# Altium schematic sheet 1010829PA_HVFlyback_GD_Testboard_GDSupply.SchDoc: Flyback
size A4; CompanyName: drivetek ag; DrawnBy: LME; Address1: industriestrasse 37; Address2: 2555 brügg; Address3: Switzerland; SheetNumber: 2; SheetTotal: 2
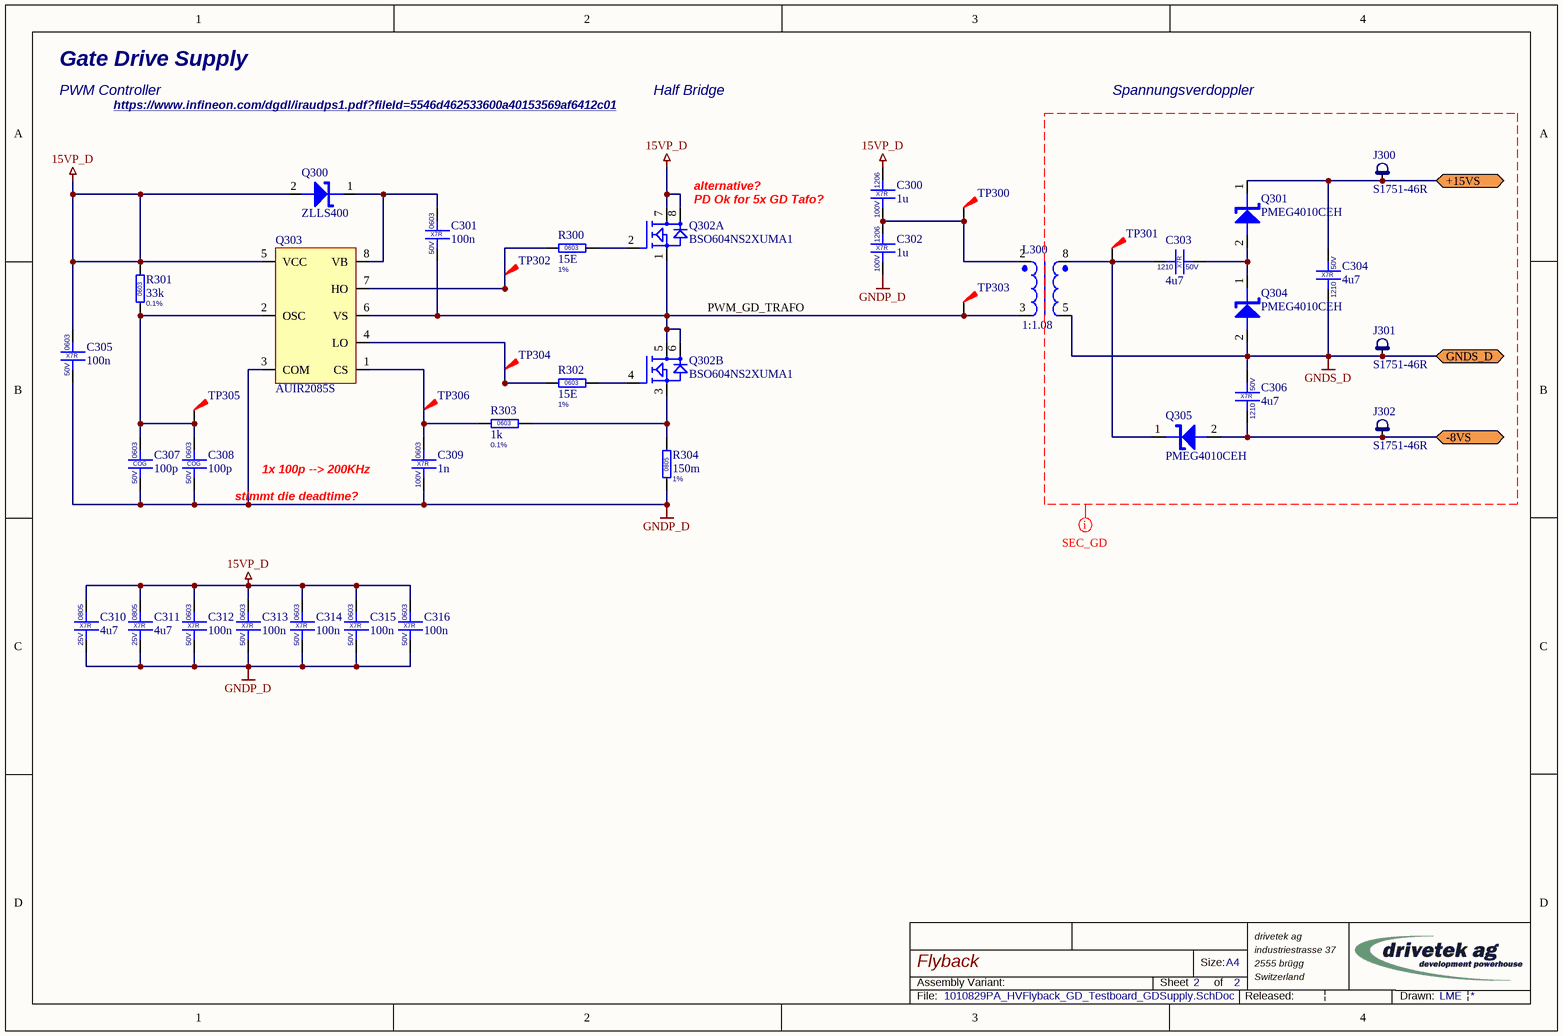
[diagram p0: 1010829PA_HVFlyback_GD_Testboard_GDSupply.SchDoc]

## Parts
C300  1u  CaseName: 1206  Type3: X7R  Voltage: 100V  [02_1206_DRK_3-4x1-8x1-8]
C301  100n  CaseName: 0603  Type3: X7R  Voltage: 50V  [02_0603_DRK_1-7x1-0x0-9]
C302  1u  CaseName: 1206  Type3: X7R  Voltage: 100V  [02_1206_DRK_3-4x1-8x1-8]
C303  4u7  CaseName: 1210  Type3: X7R  Voltage: 50V  [02_1210_DRK_3-2x2-6x2-7]
C304  4u7  CaseName: 1210  Type3: X7R  Voltage: 50V  [02_1210_DRK_3-2x2-6x2-7]
C305  100n  CaseName: 0603  Type3: X7R  Voltage: 50V  [02_0603_DRK_1-7x1-0x0-9]
C306  4u7  CaseName: 1210  Type3: X7R  Voltage: 50V  [02_1210_DRK_3-2x2-6x2-7]
C307  100p  CaseName: 0603  Type3: COG  Voltage: 50V  [02_0603_DRK_1-7x1-0x0-9]
C308  100p  CaseName: 0603  Type3: COG  Voltage: 50V  [02_0603_DRK_1-7x1-0x0-9]
C309  1n  CaseName: 0603  Type3: X7R  Voltage: 100V  [02_0603_DRK_1-7x1-0x0-9]
C310  4u7  CaseName: 0805  Type3: X7R  Voltage: 25V  [02_0805_DRK_2-2x1-5x1-3]
C311  4u7  CaseName: 0805  Type3: X7R  Voltage: 25V  [02_0805_DRK_2-2x1-5x1-3]
C312  100n  CaseName: 0603  Type3: X7R  Voltage: 50V  [02_0603_DRK_1-7x1-0x0-9]
C313  100n  CaseName: 0603  Type3: X7R  Voltage: 50V  [02_0603_DRK_1-7x1-0x0-9]
C314  100n  CaseName: 0603  Type3: X7R  Voltage: 50V  [02_0603_DRK_1-7x1-0x0-9]
C315  100n  CaseName: 0603  Type3: X7R  Voltage: 50V  [02_0603_DRK_1-7x1-0x0-9]
C316  100n  CaseName: 0603  Type3: X7R  Voltage: 50V  [02_0603_DRK_1-7x1-0x0-9]
J300  S1751-46R  [13_PAD_DRK_HARWIN_S1751-46]
J301  S1751-46R  [13_PAD_DRK_HARWIN_S1751-46]
J302  S1751-46R  [13_PAD_DRK_HARWIN_S1751-46]
L300  1:1.08  [06_TRA_DRK_TDK-B78307A2276A003]
Q300  ZLLS400  [03_SOD323_DRK]
Q301  PMEG4010CEH  [03_SOD123_DRK]
Q302  BSO604NS2XUMA1  [03_SO-8_DRK]  (parts A,B of 2)
Q303  AUIR2085S  [04_SO-8_DRK]
Q304  PMEG4010CEH  [03_SOD123_DRK]
Q305  PMEG4010CEH  [03_SOD123_DRK]
R300  15E  Tolerance: 1%  CaseName: 0603  [01_0603_DRK_1-7x1-0x0-55]
R301  33k  Tolerance: 0.1%  CaseName: 0603  [01_0603_DRK_1-7x1-0x0-55]
R302  15E  Tolerance: 1%  CaseName: 0603  [01_0603_DRK_1-7x1-0x0-55]
R303  1k  Tolerance: 0.1%  CaseName: 0603  [01_0603_DRK_1-7x1-0x0-55]
R304  150m  Tolerance: 1%  CaseName: 0805  [01_0805_DRK_2-2x1-5x0-65]
TP300  TP THT Dia 0.8mm, Hole 0.3mm  [13_TP_0-3_0-8mm]  (value not drawn)  (no BOM)
TP301  TP THT Dia 0.8mm, Hole 0.3mm  [13_TP_0-3_0-8mm]  (value not drawn)  (no BOM)
TP302  TP THT Dia 0.8mm, Hole 0.3mm  [13_TP_0-3_0-8mm]  (value not drawn)  (no BOM)
TP303  TP THT Dia 0.8mm, Hole 0.3mm  [13_TP_0-3_0-8mm]  (value not drawn)  (no BOM)
TP304  TP THT Dia 0.8mm, Hole 0.3mm  [13_TP_0-3_0-8mm]  (value not drawn)  (no BOM)
TP305  TP THT Dia 0.8mm, Hole 0.3mm  [13_TP_0-3_0-8mm]  (value not drawn)  (no BOM)
TP306  TP THT Dia 0.8mm, Hole 0.3mm  [13_TP_0-3_0-8mm]  (value not drawn)  (no BOM)

## Ports
+15VS (bidir), -8VS (bidir), GNDS_D (bidir)

## Nets
15VP_D: C300.1 C305.1 C310.1 C311.1 C312.1 C313.1 C314.1 C315.1 C316.1 Q300.2 Q302.7(D1) Q302.8(D1) Q303.5(VCC) R301.2
GNDP_D: C302.2 C305.2 C307.2 C308.2 C309.2 C310.2 C311.2 C312.2 C313.2 C314.2 C315.2 C316.2 Q303.3(COM) R304.1
GNDS_D: C304.1 C306.2 J301.1 L300.5 Q304.2 ; port GNDS_D
+15VS: C304.2 J300.1 Q301.1 ; port +15VS
-8VS: C306.1 J302.1 Q305.2 ; port -8VS
PWM_GD_TRAFO: C301.2 L300.3 Q302.1(S1) Q302.5(D2) Q302.6(D2) Q303.6(VS) TP303.1
NetC300_2: C300.2 C302.1 L300.2 TP300.1
NetC301_1: C301.1 Q300.1 Q303.8(VB)
NetC303_1: C303.1 L300.8 Q305.1 TP301.1
NetC303_2: C303.2 Q301.2 Q304.1
NetC307_1: C307.1 C308.1 Q303.2(OSC) R301.1 TP305.1
NetC309_1: C309.1 Q303.1(CS) R303.2 TP306.1
NetQ302_2: Q302.2(G1) R300.2
NetQ302_3: Q302.3(S2) R303.1 R304.2
NetQ302_4: Q302.4(G2) R302.2
NetQ303_4: Q303.4(LO) R302.1 TP304.1
NetQ303_7: Q303.7(HO) R300.1 TP302.1

## Layout directives
net class SEC_GD: GNDS_D

## Notes on the sheet
- Gate Drive Supply
- PWM Controller
- https://www.infineon.com/dgdl/iraudps1.pdf?fileId=5546d462533600a40153569af6412c01
- Half Bridge
- Spannungsverdoppler
- (near Q302) PD Ok for 5x GD Tafo?
- (near Q302) alternative?
- (near C308) stimmt die deadtime?
- 1x 100p --> 200KHz
- Assembly Variant:
- Sheet
- Size:
- of
- A4
- File:
- Released:
- |
- Drawn:

## Library data of the parts
C300 C302 = 02-0297: Part Description: Ceramic 1206 1u 100V X7R; Manufacturer 1: TDK; Manufacturer Part Number 1: C3216X7R2A105KT5; LatestRevision Note: Initial; Type1: CAP; Type2: Ceramic; Tolerance: 10; Order Number: 810-C3216X7R2A105KT5; Part Number: 02-0297; Author: CSI; PartValue: 1u; ROHS: True; ComponentLink1Description: Datasheet; ComponentLink1URL: http://www.tdk.com/pdf/general_B11.pdf; LatestRevision Date: 07.05.2013; Distributor: Mouser; Price: 0.2
C301 C305 C312-C316 = 02-0342: Part Description: Ceramic 0603 100nF 50V X7R, AEC-Q200, Fail-Save, Deflecting Crack; Manufacturer 1: Murata; Manufacturer Part Number 1: GCJ188R71H104KA12D; LatestRevision Note: Initial; Type1: CAP; Type2: Ceramic; Tolerance: 10; Order Number: 81-GCJ188R71H104KA2D; Part Number: 02-0342; Author: RLE; PartValue: 100n; ROHS: True; ComponentLink1Description: Datasheet; ComponentLink1URL: http://www.murata.com/~/media/webrenewal/support/library/catalog/products/capacitor/mlcc/c03e.ashx; LatestRevision Date: 15.07.2015; Distributor: Mouser; Price: 0.257
C303 C304 C306 = 02-0107: Part Description: Ceramic 1210 4u7 50V X7R; Manufacturer 1: muRata; Manufacturer Part Number 1: GRM32ER71H475KA88L; LatestRevision Note: Checked; Type1: CAP; Type2: Ceramic; Tolerance: 10; Checked: SBR; Order Number: 823524; Part Number: 02-0107; PartValue: 4u7; ROHS: True; ComponentLink1Description: Datasheet; ComponentLink1URL: http://search.murata.co.jp/Ceramy/image/img/PDF/ENG/GRM32ER71H475KA88.pdf; LatestRevision Date: 13.12.2006; Distributor: Distrelec; Price: 1.18
C307 C308 = 02-0380: Part Description: Ceramic 0603 100pF 50V 5% C0G  AEC-Q200; Manufacturer 1: Murata; Manufacturer Part Number 1: GCM1885C1H101JA16D; LatestRevision Note: Initial; Type1: CAP; Type2: Ceramic; Tolerance: 5; Order Number: 81-GCM1885C1H101JA6D; Part Number: 02-0380; Author: RLE; PartValue: 100p; ROHS: True; ComponentLink1Description: Datasheet; ComponentLink1URL: http://www.murata.com/products/catalog/pdf/c03e.pdf; LatestRevision Date: 12.09.2016; Distributor: Mouser; Price: 0.1
C309 = 02-0303: Part Description: Ceramic 0603 1n 100V X7R Automotive (AEC-Q200); Manufacturer 1: Murata; Manufacturer Part Number 1: GCM188R72A102KA37D; LatestRevision Note: Initial; Type1: CAP; Type2: Ceramic; Tolerance: 10; Order Number: 81-GCM188R72A102KA7D; Part Number: 02-0303; Author: RLE; PartValue: 1n; ROHS: True; ComponentLink1Description: Datasheet; ComponentLink1URL: http://search.murata.co.jp/Ceramy/image/img/A01X/G101/ENG/GCM188R72A102KA37-01.pdf; LatestRevision Date: 15.10.2013; Distributor: Mouser; Price: 0.3
C310 C311 = 02-0268: Part Description: Automotive Ceramic 0805 4.7uF 25V 10%; Manufacturer 1: TDK; Manufacturer Part Number 1: CGA4J1X7R1E475K; LatestRevision Note: Initial; Type1: CAP; Type2: Ceramic; Tolerance: 10; Order Number: 810-CGA4J1X7R1E475K; Part Number: 02-0268; Author: MFR; PartValue: 4u7; ROHS: True; ComponentLink1Description: Datasheet; ComponentLink1URL: http://www.tdk.com/pdf/general_B11.pdf; LatestRevision Date: 18.06.2012; Distributor: Mouser; Price: 0.55
J300-J302 = 13-0487: Probe Hook; Part Description: SMD Probe Hook 2mm HIGH, 3.45x1.85mm; Manufacturer 1: Harwin; LatestRevision Note: Initial; Type1: TP; Type2: SMD; Order Number: 952-1478-2-ND; Order Number 2: 855-S1751-46R; Part Number: 13-0487; Author: CSI; PartValue: S1751-46R; ROHS: True; ComponentLink1Description: Datasheet; ComponentLink1URL: https://cdn.harwin.com/pdfs/60page187.pdf; LatestRevision Date: 19.09.2016; Manufacturer Part Number 1: S1751-46R; Distributor: DigiKey; Price: 0.25; Distributor 2: Mouser
L300 = 06-0146: Gate Drive Transformer; Part Description: Gate Drive Transformer, 1:1.08, Lp=100uH; Manufacturer 1: TDK; Manufacturer Part Number 1: B78307A2276A003; LatestRevision Note: Initial; Type1: TRA; Order Number: 871-B78307A2276A003; Part Number: 06-0146; Author: NLE; PartValue: 1:1.08; CaseName: B78307A; ROHS: True; ComponentLink1Description: Datasheet; ComponentLink1URL: K:\Volkswagen\1779_LE_BZ_Luftversorgung\03_Hardware\031_Analyse_Spezifikation\BS1\Datenblätter\Gate Drive Supply\B78307A2276A003.pdf; LatestRevision Date: 04.01.2018; Distributor: Mouser; Price: 3.43
Q300 = 03-0389: Part Description: Low VF, fast switching Schottky, extremely low leakage; Manufacturer 1: Diodes; Manufacturer Part Number 1: ZLLS400TA; LatestRevision Note: Checked; Type1: DIODE; Type2: Signal; Voltage: 40V; Current: 520m; Order Number: 522-ZLLS400TA; Checked: CRA; Part Number: 03-0389; Author: RLE; PartValue: ZLLS400; CaseName: SOD323; ROHS: True; ComponentLink1Description: Datasheet; ComponentLink1URL: http://www.diodes.com/_files/datasheets/ZLLS400.pdf; LatestRevision Date: 24.03.2016; Distributor: Mouser; Price: 0.413
Q301 Q304 Q305 = 03-0124: Part Description: Diode Schottky 40V 1A SOD123; Manufacturer 1: NXP; LatestRevision Note: Checked; Type1: DIODE; Type2: Power; Voltage: 40V; Current: 1A; Checked: HHU; Order Number: 1510690; Part Number: 03-0124; Author: MSC; PartValue: PMEG4010CEH; CaseName: SOD123; ROHS: True; ComponentLink1Description: Datasheet; ComponentLink1URL: http://www.nxp.com/documents/data_sheet/PMEG4010CEH_PMEG4010CEJ.pdf; LatestRevision Date: 09.12.2008; Manufacturer Part Number 1: PMEG4010CEH; Distributor: Farnell; Price: 0.44
Q302 = 03-0419: OptiMOS Dual N-Channel 5A 55V 35mOhm, AEC-Q101; Manufacturer 1: Infineon; LatestRevision Note: Initial; Type1: NMOS; Type2: Power; Order Number: 726-BSO604NS2XUMA1; Part Number: 03-0419; Author: RVI; PartValue: BSO604NS2XUMA1; Voltage: 55V; Current: 5A; CaseName: SO-8; ROHS: True; Part Description: OptiMOS Dual N-Channel 5A 55V 35mOhm, AEC-Q101; ComponentLink1Description: Datasheet; ComponentLink1URL: https://www.infineon.com/dgdl/Infineon-BSO604NS2-DS-v01_01-en.pdf?fileId=db3a30431936bc4b01194c433efb3fda; LatestRevision Date: 03.08.2017; Manufacturer Part Number 1: BSO604NS2XUMA1; Distributor: Mouser; Price: 1
Q303 = 04-0493: High Speed Half-Bridge Driver,  Self Oscilating 50%, 1A, 100V, AEC-Q100; Manufacturer 1: Infineon; Manufacturer Part Number 1: AUIR2085STR; LatestRevision Note: Initial; Type1: MIXSIG; Part Number: 04-0493; Author: RVI; PartValue: AUIR2085S; CaseName: SO-8; ROHS: True; Part Description: High Speed Half-Bridge Driver,  Self Oscilating 50%, 1A, 100V, AEC-Q100; ComponentLink1Description: Datasheet; ComponentLink1URL: https://www.infineon.com/dgdl/auir2085s.pdf?fileId=5546d462533600a4015355a82609133f; LatestRevision Date: 03.08.2017; Distributor: Future Electronics; Order Number: AUIR2085STR; Price: 1.7
R300 R302 = 01-0771: Part Description: 0603 15E 75V 0.1W 1% 100ppm, AEC-Q200; Manufacturer 1: Panasonic; Manufacturer Part Number 1: ERJ3EKF15R0V; LatestRevision Note: Initial; Type1: RES; Type2: Thickfilm; Voltage: 75V; Power: 100m; Order Number: 2302978; Part Number: 01-0771; Author: RVI; PartValue: 15E; ROHS: True; ComponentLink1Description: Datasheet; ComponentLink1URL: http://www.farnell.com/datasheets/1911175.pdf?_ga=2.3136304.1296746569.1501662084-657638312.1494329784; LatestRevision Date: 03.08.2017; Distributor: Farnell; Price: 0.05
R301 = 01-0690: Part Description: 0603 33k 75V 0.1W 0.1% 25ppm, AEC-Q200; Manufacturer 1: Vishay; Manufacturer Part Number 1: TNPW060333K0BEEA; LatestRevision Note: Initial; Type1: RES; Type2: Thinfilm; Voltage: 75V; Power: 100m; Order Number: 71-TNPW060333K0BEEA; Part Number: 01-0690; Author: RLE; PartValue: 33k; ROHS: True; ComponentLink1Description: Datasheet; ComponentLink1URL: http://www.vishay.com/docs/28758/tnpw_e3.pdf; LatestRevision Date: 24.07.2015; Distributor: Mouser; Price: 0.35
R303 = 01-0573: Part Description: 0603 1k 75V 0.1W 0.1% 25ppm AEC-Q200; Manufacturer 1: Vishay; Manufacturer Part Number 1: TNPW06031K00BEEA; LatestRevision Note: Initial; Type1: RES; Type2: Thinfilm; Voltage: 75V; Power: 100m; Order Number: 71-TNPW06031K00BEEA; Order Number 2: TNPW06031K00BEEA-ND; Part Number: 01-0573; Author: SSC; PartValue: 1k; ROHS: True; ComponentLink1Description: Datasheet; ComponentLink1URL: http://www.vishay.com/docs/28758/tnpw_e3.pdf; LatestRevision Date: 12.06.2012; Distributor: Mouser; Price: 0.37; Distributor 2: Digikey
R304 = 01-0781: Part Description: 0805 150m Current Sense Resistor AEC-Q200; Manufacturer 1: Panasonic; Manufacturer Part Number 1: ERJ-6DSFR15V; LatestRevision Note: Initial; Type1: RES; Type2: Thickfilm; Power: 500m; Order Number: 667-ERJ-6DSFR15V; Order Number 2: P19312CT-ND; Part Number: 01-0781; Author: LME; PartValue: 150m; ROHS: True; ComponentLink1Description: Datasheet; ComponentLink1URL: https://industrial.panasonic.com/cdbs/www-data/pdf/RDN0000/AOA0000C313.pdf; LatestRevision Date: 12.01.2018; Distributor: Mouser; Price: 0.7; Distributor 2: DigiKey
TP300-TP306 = 13-0524: Part Description: Test point THT - Dia 0.8mm, Hole 0.3mm; LatestRevision Note: Initial; Type2: TH; Part Number: 13-0524; Author: RVI; Type1: TP; PartValue: TP THT Dia 0.8mm, Hole 0.3mm; CaseName: 0.8mm; ROHS: True; ComponentLink1Description: Datasheet; LatestRevision Date: 10.07.2017; Price: 0